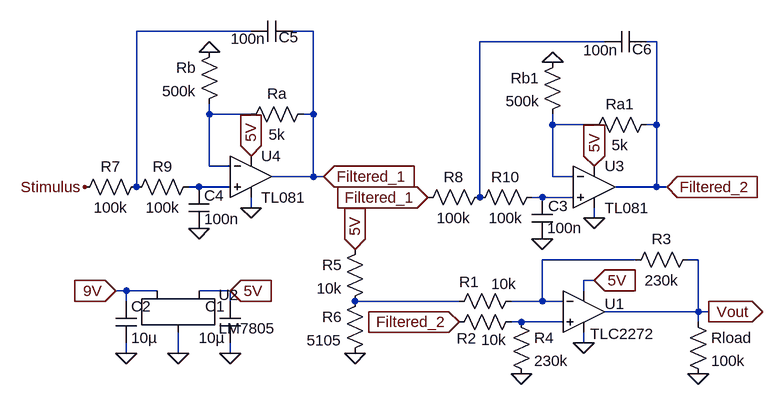
[diagram p0: schematic neat.asc]
neat.asc, the LTspice schematic file:
Version 4
SHEET 1 1824 680
WIRE -1536 -1184 -1712 -1184
WIRE -1440 -1184 -1472 -1184
WIRE -992 -1168 -1184 -1168
WIRE -912 -1168 -928 -1168
WIRE -1600 -1056 -1600 -1072
WIRE -1536 -1056 -1600 -1056
WIRE -1440 -1056 -1440 -1184
WIRE -1440 -1056 -1456 -1056
WIRE -1072 -1040 -1072 -1056
WIRE -1008 -1040 -1072 -1040
WIRE -912 -1040 -912 -1168
WIRE -912 -1040 -928 -1040
WIRE -1600 -976 -1600 -1056
WIRE -1568 -976 -1600 -976
WIRE -1440 -960 -1440 -1056
WIRE -1440 -960 -1504 -960
WIRE -1424 -960 -1440 -960
WIRE -1072 -960 -1072 -1040
WIRE -1040 -960 -1072 -960
WIRE -1712 -944 -1712 -1184
WIRE -1616 -944 -1632 -944
WIRE -1568 -944 -1616 -944
WIRE -912 -944 -912 -1040
WIRE -912 -944 -976 -944
WIRE -896 -944 -912 -944
WIRE -1184 -928 -1184 -1168
WIRE -1088 -928 -1104 -928
WIRE -1040 -928 -1088 -928
WIRE -1536 -912 -1536 -928
WIRE -1008 -896 -1008 -912
WIRE -944 -832 -1088 -832
WIRE -848 -832 -864 -832
WIRE -1008 -800 -1024 -800
WIRE -1728 -784 -1744 -784
WIRE -1680 -784 -1728 -784
WIRE -1568 -784 -1616 -784
WIRE -1024 -784 -1024 -800
WIRE -1728 -768 -1728 -784
WIRE -1568 -768 -1568 -784
WIRE -1216 -768 -1376 -768
WIRE -1088 -768 -1088 -832
WIRE -1088 -768 -1136 -768
WIRE -1056 -768 -1088 -768
WIRE -848 -752 -848 -832
WIRE -848 -752 -992 -752
WIRE -832 -752 -848 -752
WIRE -1120 -736 -1136 -736
WIRE -1056 -736 -1120 -736
WIRE -848 -736 -848 -752
WIRE -1024 -704 -1024 -720
WIRE -1728 -688 -1728 -704
WIRE -1648 -688 -1648 -720
WIRE -1568 -688 -1568 -704
FLAG -832 -752 Vout
IOPIN -832 -752 Out
FLAG -1744 -784 9V
IOPIN -1744 -784 In
FLAG -1648 -688 0
FLAG -1728 -688 0
FLAG -1568 -688 0
FLAG -848 -656 0
FLAG -1024 -704 0
FLAG -1376 -688 0
FLAG -1120 -656 0
FLAG -1792 -944 Stimulus
FLAG -1536 -912 0
FLAG -1616 -880 0
FLAG -1600 -1152 0
FLAG -1008 -896 0
FLAG -1088 -864 0
FLAG -1072 -1136 0
FLAG -1008 -800 5V
IOPIN -1008 -800 In
FLAG -1568 -784 5V
IOPIN -1568 -784 In
FLAG -1376 -848 5V
IOPIN -1376 -848 In
FLAG -1536 -992 5V
IOPIN -1536 -992 In
FLAG -1008 -976 5V
IOPIN -1008 -976 In
FLAG -1424 -960 Filtered_1
IOPIN -1424 -960 In
FLAG -1264 -928 Filtered_1
IOPIN -1264 -928 In
FLAG -896 -944 Filtered_2
IOPIN -896 -944 In
FLAG -1216 -736 Filtered_2
IOPIN -1216 -736 In
SYMBOL cap -1552 -768 M0
SYMATTR InstName C1
SYMATTR Value 10µ
SYMBOL cap -1744 -768 R0
SYMATTR InstName C2
SYMATTR Value 10µ
SYMBOL res -864 -752 R0
SYMATTR InstName Rload
SYMATTR Value 100k
SYMBOL res -848 -848 R90
WINDOW 0 0 56 VBottom 2
WINDOW 3 32 56 VTop 2
SYMATTR InstName R3
SYMATTR Value 230k
SYMBOL res -1120 -784 R90
WINDOW 0 2 80 VBottom 2
WINDOW 3 -26 27 VTop 2
SYMATTR InstName R1
SYMATTR Value 10k
SYMBOL Opamps\\opamp2 -1024 -816 R0
WINDOW 3 10 98 Left 2
WINDOW 0 32 52 Left 2
SYMATTR Value TLC2272
SYMATTR InstName U1
SYMBOL res -1360 -784 M0
SYMATTR InstName R6
SYMATTR Value 5105
SYMBOL res -1360 -864 M0
SYMATTR InstName R5
SYMATTR Value 10k
SYMBOL res -1136 -752 R0
SYMATTR InstName R4
SYMATTR Value 230k
SYMBOL res -1120 -752 R90
WINDOW 0 57 84 VBottom 2
WINDOW 3 28 42 VTop 2
SYMATTR InstName R2
SYMATTR Value 10k
SYMBOL res -1696 -960 R90
WINDOW 0 0 56 VBottom 2
WINDOW 3 32 56 VTop 2
SYMATTR InstName R7
SYMATTR Value 100k
SYMBOL cap -1632 -944 R0
WINDOW 3 24 49 Left 2
WINDOW 0 24 13 Left 2
SYMATTR Value 100n
SYMATTR InstName C4
SYMBOL Opamps\\opamp2 -1536 -1024 R0
SYMATTR InstName U4
SYMATTR Value TL081
SYMBOL res -1616 -960 R90
WINDOW 0 0 56 VBottom 2
WINDOW 3 32 56 VTop 2
SYMATTR InstName R9
SYMATTR Value 100k
SYMBOL res -1440 -1072 R90
WINDOW 0 0 56 VBottom 2
WINDOW 3 32 56 VTop 2
SYMATTR InstName Ra
SYMATTR Value 5k
SYMBOL res -1584 -1168 M0
SYMATTR InstName Rb
SYMATTR Value 500k
SYMBOL cap -1472 -1200 R90
WINDOW 0 41 6 VBottom 2
WINDOW 3 12 68 VTop 2
SYMATTR InstName C5
SYMATTR Value 100n
SYMBOL res -1168 -944 R90
WINDOW 0 0 56 VBottom 2
WINDOW 3 32 56 VTop 2
SYMATTR InstName R8
SYMATTR Value 100k
SYMBOL cap -1104 -928 R0
WINDOW 3 24 47 Left 2
WINDOW 0 25 13 Left 2
SYMATTR Value 100n
SYMATTR InstName C3
SYMBOL Opamps\\opamp2 -1008 -1008 R0
SYMATTR InstName U3
SYMATTR Value TL081
SYMBOL res -1088 -944 R90
WINDOW 0 0 56 VBottom 2
WINDOW 3 32 56 VTop 2
SYMATTR InstName R10
SYMATTR Value 100k
SYMBOL res -912 -1056 R90
WINDOW 0 0 56 VBottom 2
WINDOW 3 32 56 VTop 2
SYMATTR InstName Ra1
SYMATTR Value 5k
SYMBOL res -1056 -1152 M0
SYMATTR InstName Rb1
SYMATTR Value 500k
SYMBOL cap -928 -1184 R90
WINDOW 0 43 6 VBottom 2
WINDOW 3 14 70 VTop 2
SYMATTR InstName C6
SYMATTR Value 100n
SYMBOL LM7805 -1648 -768 R0
SYMATTR InstName U2

The netlist it stands for:
* neat.asc
C1 5V 0 10µ
C2 9V 0 10µ
Rload Vout 0 100k
R3 Vout N007 230k
R1 N007 N008 10k
XU1 N009 N007 5V 0 Vout TLC2272  ; pins In+ In- V+ V- OUT
R6 N008 0 5105
R5 5V N008 10k
R4 N009 0 230k
R2 N009 Filtered_2 10k
R7 N001 Stimulus 100k
C4 N005 0 100n
XU4 N005 N003 5V 0 Filtered_1 TL081  ; pins In+ In- V+ V- OUT
R9 N005 N001 100k
Ra Filtered_1 N003 5k
Rb 0 N003 500k
C5 Filtered_1 N001 100n
R8 N002 Filtered_1 100k
C3 N006 0 100n
XU3 N006 N004 5V 0 Filtered_2 TL081  ; pins In+ In- V+ V- OUT
R10 N006 N002 100k
Ra1 Filtered_2 N004 5k
Rb1 0 N004 500k
C6 Filtered_2 N002 100n
XU2 9V 0 5V LM7805
.backanno
.end